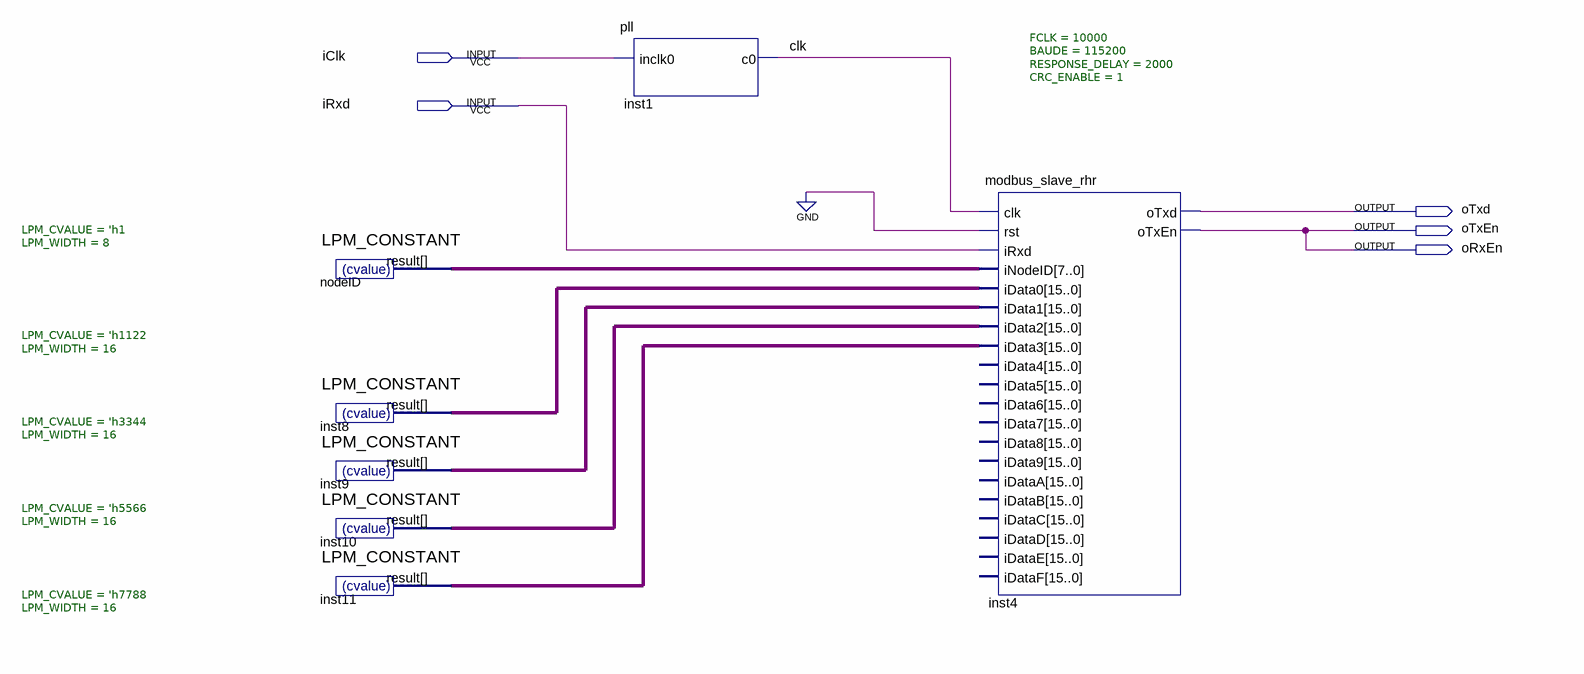
[diagram p0: schematic sheet]
// Quartus schematic serial_example_top.bdf as structural Verilog: 7 symbols, 5 pins
module serial_example_top (
  input  iClk,
  input  iRxd,
  output oTxd,
  output oTxEn,
  output oRxEn
);

  wire clk;
  wire [7:0] nodeID_result;
  wire [15:0] inst8_result, inst9_result, inst10_result, inst11_result;

  LPM_CONSTANT #(.LPM_CVALUE('h1), .LPM_WIDTH(8)) nodeID (.result(nodeID_result));
  LPM_CONSTANT #(.LPM_CVALUE('h1122), .LPM_WIDTH(16)) inst8 (.result(inst8_result));
  LPM_CONSTANT #(.LPM_CVALUE('h3344), .LPM_WIDTH(16)) inst9 (.result(inst9_result));
  LPM_CONSTANT #(.LPM_CVALUE('h5566), .LPM_WIDTH(16)) inst10 (.result(inst10_result));
  LPM_CONSTANT #(.LPM_CVALUE('h7788), .LPM_WIDTH(16)) inst11 (.result(inst11_result));
  pll inst1 (.inclk0(iClk), .c0(clk));
  modbus_slave_rhr #(.FCLK(10000), .BAUDE(115200), .RESPONSE_DELAY(2000), .CRC_ENABLE(1)) inst4 (
    .clk(clk), .rst(1'b0), .iRxd(iRxd), .iNodeID(nodeID_result), .iData0(inst8_result),
    .iData1(inst9_result), .iData2(inst10_result), .iData3(inst11_result), .oTxd(oTxd), .oTxEn(oRxEn));  // open: iData4, iData5, iData6, iData7, iData8, iData9, iDataA, iDataB, iDataC, iDataD, iDataE, iDataF

  assign oTxEn = oRxEn;
endmodule
